# Altium schematic sheet WifiNode_Pwr.SchDoc: Power
size A4; Author: Matias Pardo Errecarret; Revision: 1; SheetNumber: 2; SheetTotal: 5
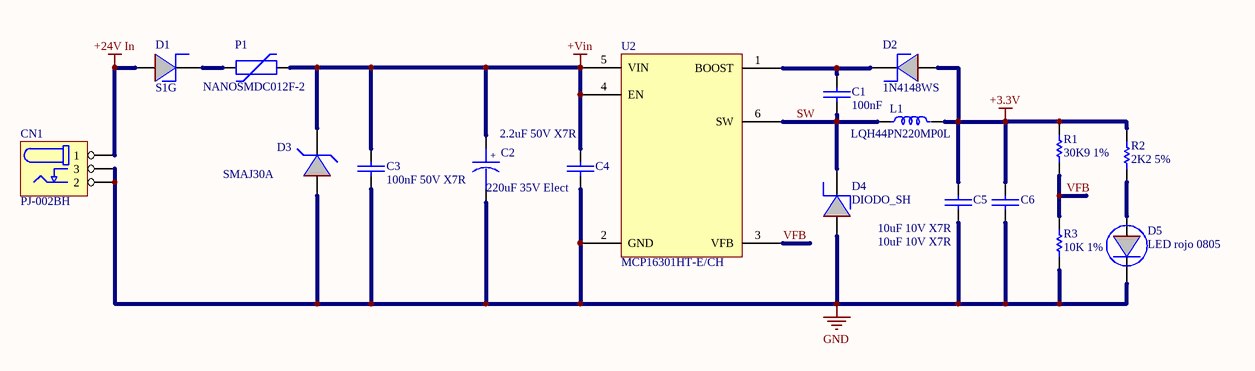
[diagram p0: WifiNode_Pwr.SchDoc]

## Parts
C1  100nF  [C_0805]
C2  220uF 35V Elect  [C_RAD_0.135_H_8X12_S]
C3  100nF 50V X7R  [C_0805]
C4  2.2uF 50V X7R  [C_0805]
C5  10uF 10V X7R  [C_0805]
C6  10uF 10V X7R  [C_0805]
CN1  PJ-002BH  [PJ002B]
D1  S1G  [D_SMA]
D2  1N4148WS  [D_SMA]
D3  SMAJ30A  [D_SMA]
D4  DIODO_SH  [D_SMA]
D5  LED rojo 0805  [D_0805]
L1  LQH44PN220MP0L  [LQH44]
P1  NANOSMDC012F-2  [NANOSMDC]
R1  30K9 1%  [R_0805]
R2  2K2 5%  [R_0805]
R3  10K 1%  [R_0805]
U2  MCP16301HT-E/CH  [SOT23-6]

## Nets
+3.3V: C5.1 C6.1 D2.1(A) L1.2 R1.2 R2.2
+24V In: CN1.1 D1.1(A)
+Vin: C2.1 C3.1 C4.1 D3.2(K) P1.2 U2.4(EN) U2.5(VIN)
GND: C2.2 C3.2 C4.2 C5.2 C6.2 CN1.2 CN1.3 D3.1(A) D4.1(A) D5.2(K) R3.1 U2.2(GND)
SW: C1.2 D4.2(K) L1.1 U2.6(SW)
VFB: R1.1 R3.2 U2.3(VFB)
NetC1_1: C1.1 D2.2(K) U2.1(BOOST)
NetD1_2: D1.2(K) P1.1
NetD5_1: D5.1(A) R2.1

## Notes on the sheet
- Title:
- Size:
- Author:
- A4
- Sheet
- of
- Revision:
- File:
- Date:
- (in symbol CAP_P) +

## Library data of the parts
C1 C3-C6 = CAP: Non Polarized Capacitor
C2 = CAP_P: Polarized Capacitor
CN1 = CN_PowerJack: Barrel Power Connector
D1 D2 D4 = DIODO_SH: Diode Shottky
D3 = DIODE_TVS: Unidirectional TVS
D5 = LED
L1 = IND: Inductor
P1 = PLYSW: Polyswitch
R1-R3 = Res1: Resistor
U2 = MCP16301: Buck 36V-adj 600mA SOT-6